# EAGLE design optoshield3 (EAGLE 6.6.0)
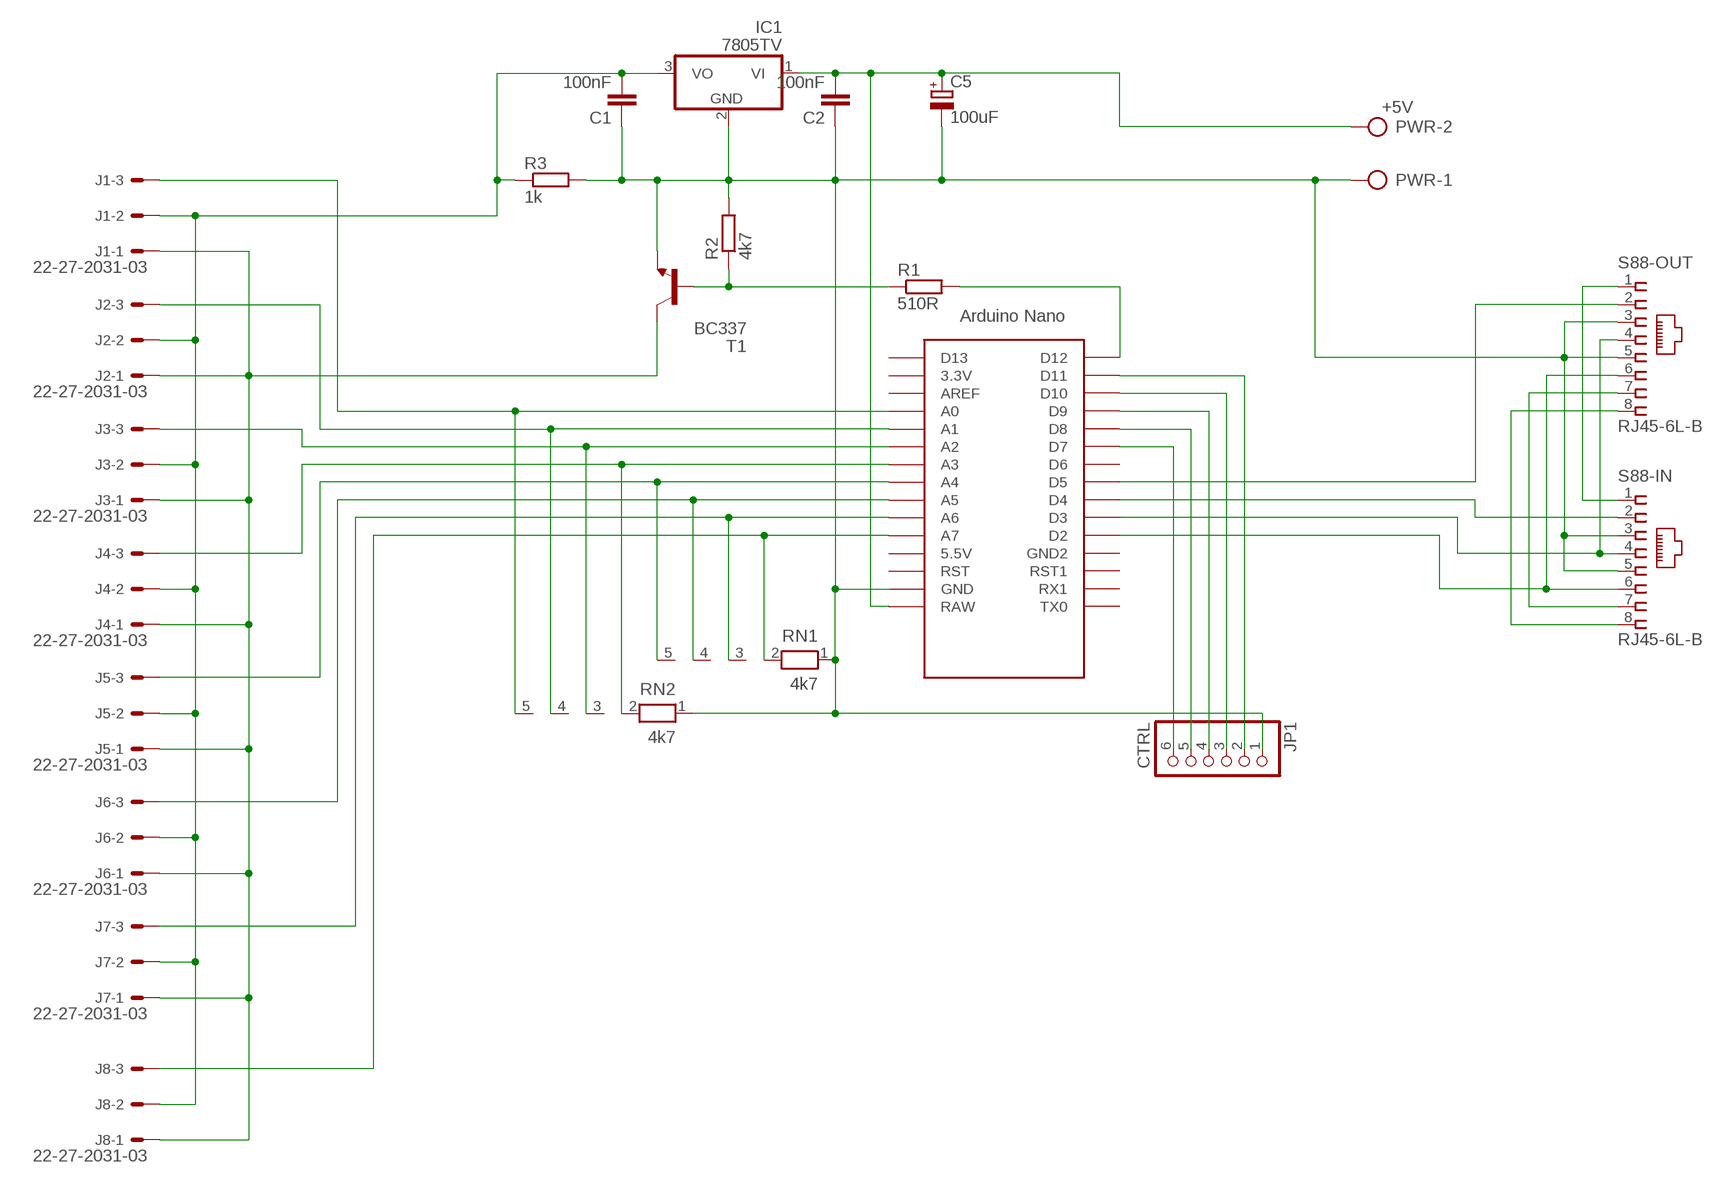
[diagram p0: schematic, sheet 1]

## Parts
C1  100nF  C-EU025-025X050  [C025-025X050]
C2  100nF  C-EU025-025X050  [C025-025X050]
C5  100uF  CPOL-EUE3.5-10  [E3,5-10]
IC1  7805TV  [TO220V]
J1  22-27-2031-03  [6410-03]
J2  22-27-2031-03  [6410-03]
J3  22-27-2031-03  [6410-03]
J4  22-27-2031-03  [6410-03]
J5  22-27-2031-03  [6410-03]
J6  22-27-2031-03  [6410-03]
J7  22-27-2031-03  [6410-03]
J8  22-27-2031-03  [6410-03]
JP1  CTRL  PINHD-1X6  [1X06]
PWR  +5V  AK500/2  [AK500/2]
R1  510R  R-EU_0207/10  [0207/10]
R2  4k7  R-EU_0207/10  [0207/10]
R3  1k  R-EU_0207/10  [0207/10]
RN1  4k7  RN04  [RN-5]
RN2  4k7  RN04  [RN-5]
S88-IN  RJ45-6L-B  [RJ45-NO-SHIELD]
S88-OUT  RJ45-6L-B  [RJ45-NO-SHIELD]
T1  BC337  [TO92]
U$1  NANO  [NANO]

## Nets
GND: C1.1 C2.1 C5.- IC1.2(GND) JP1.1 PWR.1 R2.2 R3.2 RN1.1 RN2.1 S88-IN.3 S88-IN.5 S88-OUT.3 S88-OUT.5 T1.1(E) U$1.GND
N$1: C2.2 C5.+ IC1.1(VI) PWR.2 U$1.RAW
N$2: S88-IN.1 S88-OUT.1
N$3: R1.1 R2.1 T1.2(B)
N$5: J1.3 RN2.5 U$1.A0
N$6: J4.3 RN2.2 U$1.A3
N$7: J5.3 RN1.5 U$1.A4
N$8: J2.3 RN2.4 U$1.A1
N$9: J3.3 RN2.3 U$1.A2
N$10: J6.3 RN1.4 U$1.A5
N$11: J7.3 RN1.3 U$1.A6
N$12: J8.3 RN1.2 U$1.A7
N$13: R1.2 U$1.D12
N$14: S88-IN.8 S88-OUT.8
N$15: S88-IN.6 S88-OUT.6 U$1.D2
N$17: S88-IN.7 S88-OUT.7
N$18: S88-IN.4 S88-OUT.4 U$1.D3
N$19: S88-IN.2 U$1.D4
N$20: J1.1 J2.1 J3.1 J4.1 J5.1 J6.1 J7.1 J8.1 T1.3(C)
N$21: S88-OUT.2 U$1.D5
N$22: C1.2 IC1.3(VO) J1.2 J2.2 J3.2 J4.2 J5.2 J6.2 J7.2 J8.2 R3.1
N$23: JP1.2 U$1.D11
N$24: JP1.3 U$1.D10
N$25: JP1.4 U$1.D9
N$26: JP1.5 U$1.D8
N$27: JP1.6 U$1.D7
Unconnected: U$1.3.3V U$1.5V(5.5V) U$1.AREF U$1.D6 U$1.D13 U$1.GND1(GND2) U$1.ICSP1 U$1.ICSP2 U$1.ICSP3 U$1.ICSP4 U$1.ICSP5 U$1.ICSP6 U$1.RST U$1.RST1 U$1.RX1 U$1.TX0

## Library data of the parts
C1 C2 = rcl:C-EU: CAPACITOR, European symbol
C5 = resistor:CPOL-EU: POLARIZED CAPACITOR, European symbol
IC1 = linear:78*: Positive VOLTAGE REGULATOR Source: http://cache.national.com/ds/LM/LM78L05.pdf http://www.fairchildsemi.com/ds/LM/LM7805.pdf
J1-J8 = con-molex:22-?-03: CONNECTOR wire to board 2.54 mm (.1 inch) pitch header; OC_FARNELL: unknown; OC_NEWARK: unknown
JP1 = pinhead:PINHD-1X6: PIN HEADER
PWR = con-ptr500:AK500/2: CONNECTOR; OC_FARNELL: unknown; OC_NEWARK: unknown
R1 R2 = rcl:R-EU_: RESISTOR, European symbol
R3 = resistor:R-EU_: RESISTOR, European symbol
RN1 RN2 = resistor-net:RN04: RESISTOR NETWORK; OC_FARNELL: unknown; OC_NEWARK: unknown
S88-IN S88-OUT = con-tycoelectronics:RJ45: CORCOM Modular RJ Jacks No Shield Source: www.tycoelectronics.com .. ENG_DS_1654001_1099_RJ_L_0507.pdf; MPN: RJ45-6L-B; OC_FARNELL: unknown; OC_NEWARK: 16R6090
T1 = transistor:BC337: NPN TRANSISTOR
U$1 = Arduino-clone:NANO: Arduino Nano

## Board
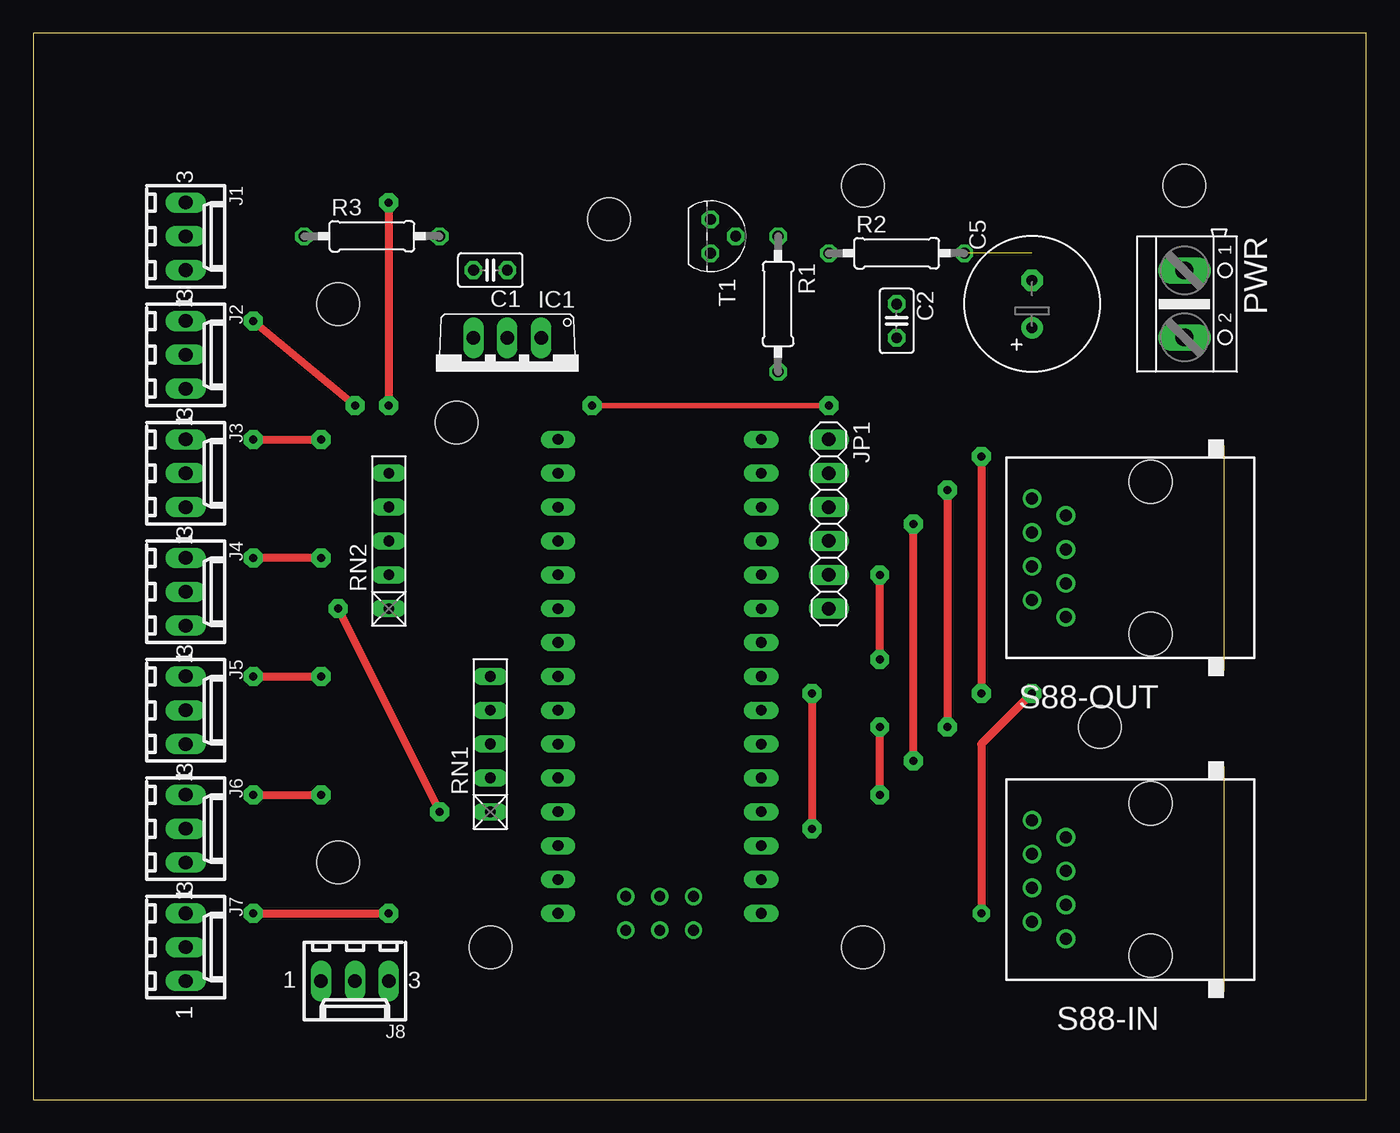
[diagram p1: board, top side]
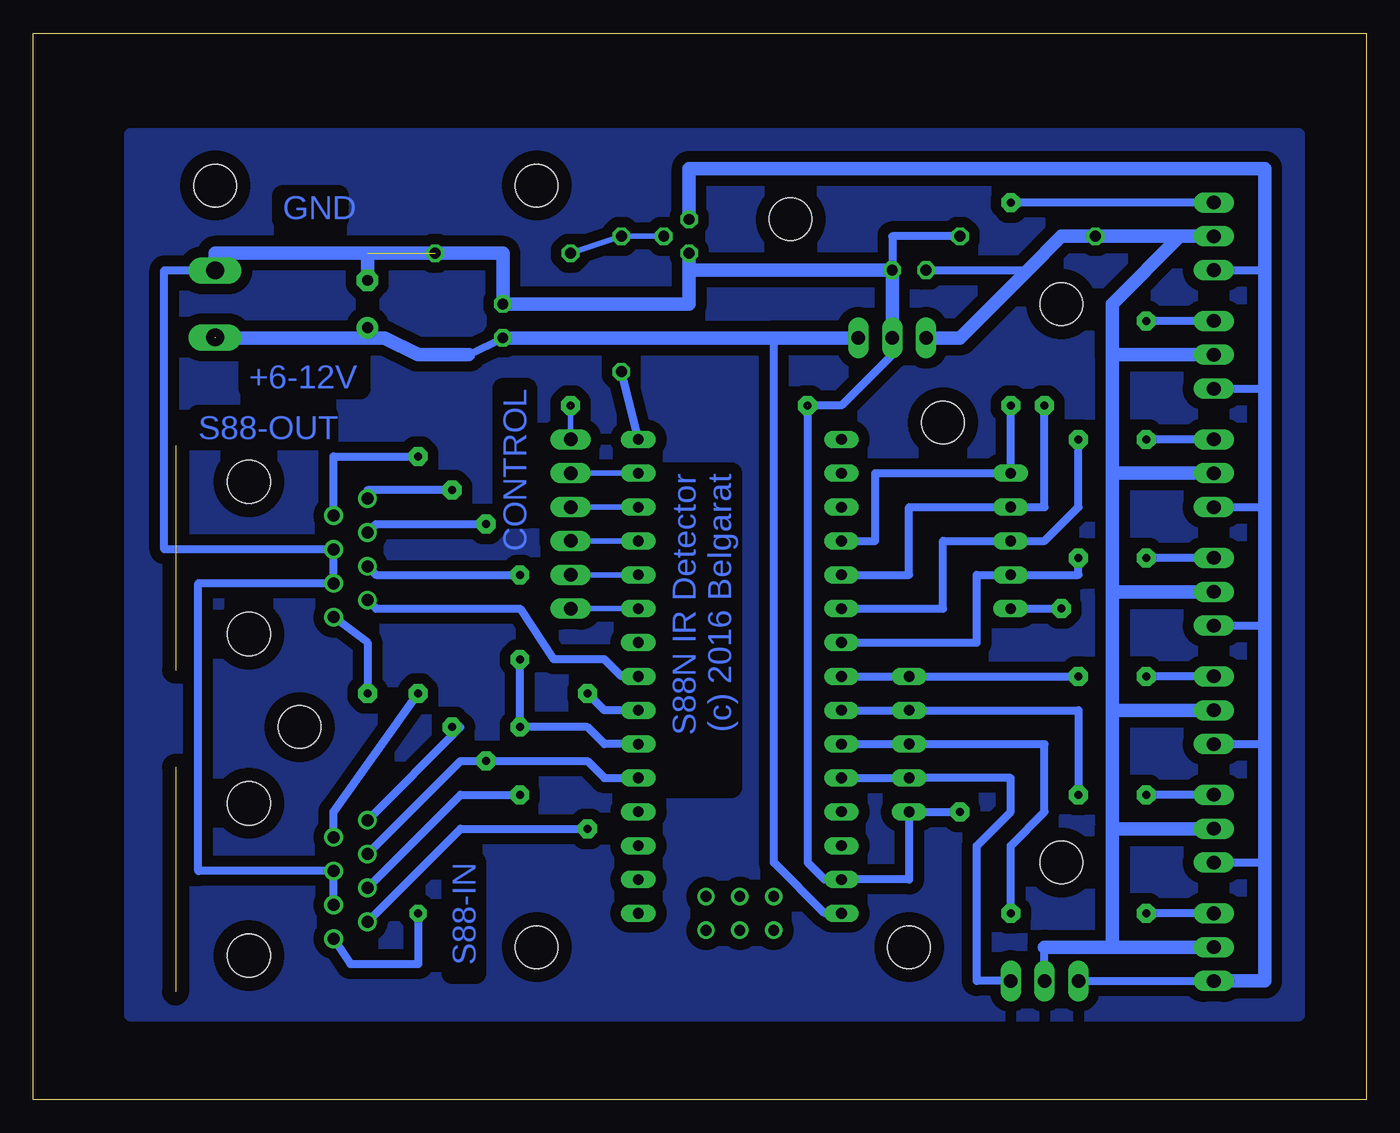
[diagram p2: board, bottom side, seen from below]

Size 100 x 80 mm. Coordinates in mm from the lower left corner, seen from the top.
Outline: 0,0 100,0 100,80 0,80 0,0
Copper layers (1*16): Top 0.035mm / dielectric 1.5mm / Bottom 0.035mm
Design rules "default *": minimum track width 10mil, minimum drill 0.6mm, track to track 8mil, track to pad 8mil, pad to pad 8mil, via to via 8mil, smd to smd 8mil, copper to edge 40mil, drill to drill 8mil, minimum pad ring 10mil, minimum via ring 8mil, stop-mask expansion 4mil, vias tented up to drill 0mil, thermal gap 10mil
Holes 3.2 mm at 31.75,50.8 34.29,11.43 22.86,17.78 22.86,59.69 43.18,66.04 80.01,27.94 86.36,68.58 62.23,11.43 62.23,68.58

### Footprints (pad centres in the part's own frame; a part is rotated, then mirrored left to right if it is on the bottom)
C025-025X050 = drill 0.813 octagon: 1 -1.27,0; 2 1.27,0
E3,5-10 = drill 0.813 pad 1.6: + -1.778,0 | drill 0.813 pad 1.6 octagon: - 1.778,0
TO220V = drill 1.016 long: 1 -2.54,-2.54; 2 0,-2.54; 3 2.54,-2.54
6410-03 = drill 1.016 long: 1 2.54,0; 2 0,0; 3 -2.54,0
1X06 = drill 1.016 long: 1 -6.35,0; 2 -3.81,0; 3 -1.27,0; 4 1.27,0; 5 3.81,0; 6 6.35,0
AK500/2 = drill 1.321 long: 1 -2.515,0; 2 2.515,0
0207/10 = drill 0.813 octagon: 1 -5.08,0; 2 5.08,0
RN-5 = drill 0.813 long: 1 -5.08,0; 2 -2.54,0; 3 0,0; 4 2.54,0; 5 5.08,0
RJ45-NO-SHIELD = drill 0.9 pad 1.4: 1 -4.445,6.35; 2 -3.175,8.89; 3 -1.905,6.35; 4 -0.635,8.89; 5 0.635,6.35; 6 1.905,8.89; 7 3.175,6.35; 8 4.445,8.89 | hole 3.251: -5.715,0; 5.715,0
TO92 = drill 0.813 octagon: 1 1.27,0; 2 0,1.905; 3 -1.27,0
NANO = drill 0.8 long: 3.3V -10.16,24.13; 5V -10.16,-1.27; A0 -10.16,19.05; A1 -10.16,16.51; A2 -10.16,13.97; A3 -10.16,11.43; A4 -10.16,8.89; A5 -10.16,6.35; A6 -10.16,3.81; A7 -10.16,1.27; AREF -10.16,21.59; D2 5.08,1.27; D3 5.08,3.81; D4 5.08,6.35; D5 5.08,8.89; D6 5.08,11.43; D7 5.08,13.97; D8 5.08,16.51; D9 5.08,19.05; D10 5.08,21.59; D11 5.08,24.13; D12 5.08,26.67; D13 -10.16,26.67; GND -10.16,-6.35; GND1 5.08,-1.27; RAW -10.16,-8.89; RST -10.16,-3.81; RST1 5.08,-3.81; RX1 5.08,-6.35; TX0 5.08,-8.89 | drill 0.8: ICSP1 -5.08,-10.16; ICSP2 -5.08,-7.62; ICSP3 -2.54,-10.16; ICSP4 -2.54,-7.62; ICSP5 0,-10.16; ICSP6 0,-7.62

### Placement (x,y rotation side)
C1  34.29,62.23 180 top
C2  64.77,58.42 270 top
C5  74.93,59.69 90 top
IC1  35.56,54.61 180 top
J1  11.43,64.77 270 top
J2  11.43,55.88 270 top
J3  11.43,46.99 270 top
J4  11.43,38.1 270 top
J5  11.43,29.21 270 top
J6  11.43,20.32 270 top
J7  11.43,11.43 270 top
J8  24.13,8.89 180 top
JP1  59.69,43.18 270 top
PWR  86.36,59.69 270 top
R1  55.88,59.69 270 top
R2  64.77,63.5 0 top
R3  25.4,64.77 0 top
RN1  34.29,26.67 90 top
RN2  26.67,41.91 90 top
S88-IN  83.82,16.51 90 top
S88-OUT  83.82,40.64 90 top
T1  50.8,64.77 270 top
U$1  49.53,22.86 0 top

### Tracks (layer width: path | path; a pad name or v marks a point on that pad's centre or on a via)
GND  (via drill 0.6 pad 1.42)  (3 unrouted)
  Top 0.406: 41.91,52.07 59.69,52.07
  Top 0.61: v22.86,36.83 v30.48,21.59
  Bottom 0.406: JP1.1 59.69,52.07
  Bottom 0.61: v30.48,21.59 RN1.1 34.29,16.51 U$1.GND 40.64,16.51 41.91,17.78 41.91,52.07 39.37,52.07 35.56,55.88 IC1.2 | RN2.1 v22.86,36.83 | R3.2 35.56,64.77 C1.1 | S88-IN.3 S88-IN.5 87.63,17.14 87.63,38.73 S88-OUT.3 S88-OUT.5 90.17,41.27 90.17,62.23 86.36,62.23
  Bottom 1.016: T1.1 50.8,62.23 | 50.8,62.23 50.8,59.69 C2.1 64.77,63.5 74.93,63.5 | IC1.2 C1.1 50.8,62.23 | 74.93,63.5 86.36,63.5 86.36,62.23 PWR.1 | C5.- 74.93,63.5
N16
  pour Bottom (isolate 0.813): 5.08,72.39 92.71,72.39 92.71,6.35 5.08,6.35
N$1  (1 unrouted)
  Bottom 0.61: 67.33,55.91 C2.2 | U$1.RAW 40.64,13.97 44.45,17.78 44.45,57.15
  Bottom 1.016: C2.2 44.45,57.15 IC1.1 | 67.33,55.91 71.14,55.91 73.66,57.15 74.93,57.15 | 74.93,57.15 86.33,57.15 | C5.+ 74.93,57.15
N$2  (via drill 0.6 pad 1.27, 0.6 pad 1.42)
  Top 0.61: v74.93,30.48 71.12,26.67 v71.12,13.97
  Bottom 0.61: S88-IN.1 76.2,10.16 71.12,10.16 v71.12,13.97 | S88-OUT.1 74.93,34.29 v74.93,30.48
N$3
  Bottom 0.406: T1.2 R1.1 R2.1
N$5  (via drill 0.6 pad 1.42)
  Top 0.61: v26.67,67.31 v26.67,52.07
  Bottom 0.61: U$1.A0 36.83,41.91 36.83,46.99 RN2.5 v26.67,52.07 | J1.3 v26.67,67.31
N$6  (via drill 0.6 pad 1.42)
  Top 0.61: v21.59,40.64 v16.51,40.64
  Bottom 0.61: U$1.A3 29.21,34.29 29.21,39.37 RN2.2 21.59,39.37 v21.59,40.64 | J4.3 v16.51,40.64
N$7  (via drill 0.6 pad 1.42)
  Top 0.61: v16.51,31.75 v21.59,31.75
  Bottom 0.61: U$1.A4 RN1.5 v21.59,31.75 | J5.3 v16.51,31.75
N$8  (via drill 0.6 pad 1.42)
  Top 0.61: v16.51,58.42 v24.13,52.07
  Bottom 0.61: U$1.A1 34.29,39.37 34.29,44.45 RN2.4 24.13,44.45 v24.13,52.07 | J2.3 v16.51,58.42
N$9  (via drill 0.6 pad 1.42)
  Top 0.61: v16.51,49.53 v21.59,49.53
  Bottom 0.61: U$1.A2 31.75,36.83 31.75,41.91 RN2.3 24.13,41.91 21.59,44.45 v21.59,49.53 | J3.3 v16.51,49.53
N$10  (via drill 0.6 pad 1.42)
  Top 0.61: v16.51,22.86 v21.59,22.86
  Bottom 0.61: U$1.A5 RN1.4 21.59,29.21 v21.59,22.86 | J6.3 v16.51,22.86
N$11  (via drill 0.6 pad 1.42)
  Top 0.61: v16.51,13.97 v26.67,13.97
  Bottom 0.61: U$1.A6 RN1.3 24.13,26.67 24.13,21.59 26.67,19.05 v26.67,13.97 | J7.3 v16.51,13.97
N$12
  Bottom 0.61: U$1.A7 RN1.2 26.67,24.13 26.67,21.59 29.21,19.05 29.21,8.89 J8.3
N$13
  Bottom 0.61: U$1.D12 R1.2
N$14  (via drill 0.6 pad 1.42)
  Top 0.61: v68.58,45.72 v68.58,27.94
  Bottom 0.61: S88-IN.8 67.94,27.94 v68.58,27.94 | v68.58,45.72 74.93,45.72 S88-OUT.8
N$15  (via drill 0.6 pad 1.42)
  Top 0.61: v66.04,25.4 v66.04,43.18
  Bottom 0.61: S88-IN.6 67.94,25.4 v66.04,25.4 58.42,25.4 57.15,24.13 U$1.D2 | S88-OUT.6 74.3,43.18 v66.04,43.18
N$17  (via drill 0.6 pad 1.42)
  Top 0.61: v71.12,48.26 v71.12,30.48
  Bottom 0.61: S88-IN.7 77.47,21.59 v71.12,30.48 | S88-OUT.7 77.47,48.26 v71.12,48.26
  other vias: 59.69,52.07 41.91,52.07
N$18  (via drill 0.6 pad 1.42)
  Top 0.61: v63.5,22.86 v63.5,27.94 | v63.5,33.02 v63.5,39.37
  Bottom 0.61: S88-IN.4 67.94,22.86 v63.5,22.86 | S88-OUT.4 74.3,39.37 v63.5,39.37 | U$1.D3 57.15,26.67 58.42,27.94 v63.5,27.94 v63.5,33.02
N$19  (via drill 0.6 pad 1.42)
  Top 0.61: v58.42,30.48 v58.42,20.32
  Bottom 0.61: S88-IN.2 67.94,20.32 v58.42,20.32 | U$1.D4 57.15,29.21 v58.42,30.48
N$20
  Bottom 0.61: J1.1 7.62,62.23 | J2.1 7.62,53.34 | J3.1 7.62,44.45 | J4.1 7.62,35.56 | J6.1 7.62,17.78 | J5.1 7.62,26.67 | J8.1 J7.1
  Bottom 1.016: J7.1 7.62,8.89 7.62,17.78 7.62,26.67 7.62,35.56 7.62,44.45 7.62,53.34 7.62,62.23 7.62,69.85 50.8,69.85 T1.3
N$21
  Bottom 0.61: S88-OUT.2 74.3,36.83 63.5,36.83 60.96,33.02 57.15,33.02 55.88,31.75 U$1.D5
N$22
  Bottom 0.61: J5.2 16.51,29.21 | J8.2 24.13,11.43 | C1.2 25.4,62.23
  Bottom 1.016: 19.05,11.43 J7.2 | J6.2 19.05,20.32 | 19.05,20.32 19.05,11.43 | J5.2 19.05,29.21 | 19.05,29.21 19.05,20.32 | J4.2 19.05,38.1 | 19.05,38.1 19.05,29.21 | J3.2 19.05,46.99 | 19.05,46.99 19.05,38.1 | J2.2 19.05,55.88 | 19.05,55.88 19.05,46.99 | J1.2 13.97,64.77 | 13.97,64.77 R3.1 22.86,64.77 25.4,62.23 30.48,57.15 IC1.3 | 24.13,11.43 19.05,11.43 | 19.05,55.88 19.05,59.69 13.97,64.77
N$23
  Bottom 0.406: U$1.D11 JP1.2
N$24
  Bottom 0.406: JP1.3 U$1.D10
N$25
  Bottom 0.406: U$1.D9 JP1.4
N$26
  Bottom 0.406: JP1.5 U$1.D8
N$27
  Bottom 0.406: U$1.D7 JP1.6

### Text on the board
Bottom: GND | CONTROL | +6-12V | S88-OUT | S88N IR Detector / (c) 2016 Belgarat | S88-IN